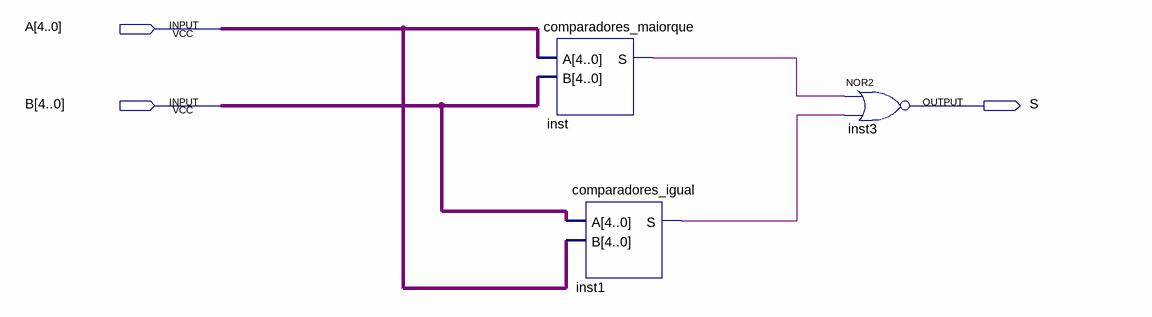
[diagram p0: schematic sheet]
// Quartus schematic comparadores_menorque.bdf as structural Verilog: 3 symbols, 3 pins
module comparadores_menorque (
  input  [4:0] A,
  input  [4:0] B,
  output S
);

  wire inst1_s, inst_s;

  comparadores_maiorque inst (.A(A), .B(B), .S(inst_s));
  comparadores_igual inst1 (.A(B), .B(A), .S(inst1_s));
  nor inst3 (S, inst_s, inst1_s);
endmodule
